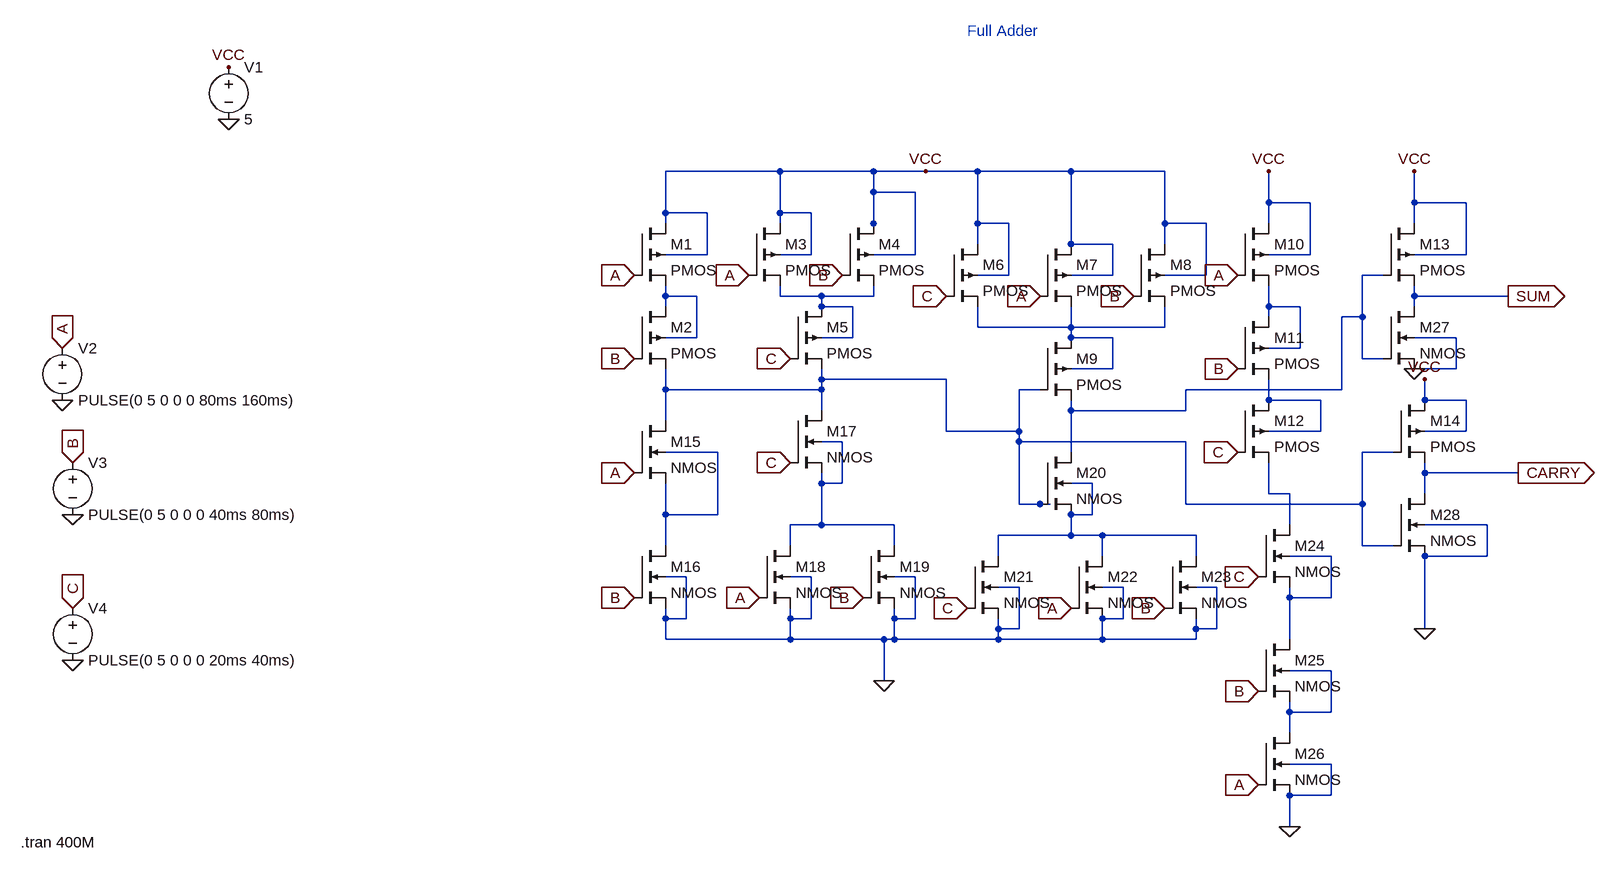
[diagram p0: schematic full adder.asc]
full adder.asc, the LTspice schematic file:
Version 4
SHEET 1 1472 1016
WIRE 128 -32 -48 -32
WIRE 272 -32 128 -32
WIRE 352 -32 272 -32
WIRE 432 -32 352 -32
WIRE 576 -32 432 -32
WIRE 720 -32 576 -32
WIRE 272 0 272 -32
WIRE 336 0 272 0
WIRE 880 16 880 -32
WIRE 944 16 880 16
WIRE 1104 16 1104 -32
WIRE 1184 16 1104 16
WIRE -48 32 -48 -32
WIRE 16 32 -48 32
WIRE 128 32 128 -32
WIRE 176 32 128 32
WIRE -48 48 -48 32
WIRE 128 48 128 32
WIRE 272 48 272 0
WIRE 432 48 432 -32
WIRE 480 48 432 48
WIRE 720 48 720 -32
WIRE 784 48 720 48
WIRE 880 48 880 16
WIRE 1104 48 1104 16
WIRE 272 64 272 48
WIRE 432 80 432 48
WIRE 576 80 576 -32
WIRE 640 80 576 80
WIRE 720 80 720 48
WIRE 16 96 16 32
WIRE 16 96 -48 96
WIRE 176 96 176 32
WIRE 176 96 128 96
WIRE 336 96 336 0
WIRE 336 96 272 96
WIRE 944 96 944 16
WIRE 944 96 880 96
WIRE 1184 96 1184 16
WIRE 1184 96 1104 96
WIRE 480 128 480 48
WIRE 480 128 432 128
WIRE 640 128 640 80
WIRE 640 128 576 128
WIRE 784 128 784 48
WIRE 784 128 720 128
WIRE 1056 128 1024 128
WIRE -48 160 -48 144
WIRE 0 160 -48 160
WIRE 128 160 128 144
WIRE 192 160 128 160
WIRE 272 160 272 144
WIRE 272 160 192 160
WIRE 1104 160 1104 144
WIRE 1248 160 1104 160
WIRE -48 176 -48 160
WIRE 192 176 192 160
WIRE 240 176 192 176
WIRE 880 176 880 144
WIRE 928 176 880 176
WIRE 1104 176 1104 160
WIRE 880 192 880 176
WIRE 1024 192 1024 128
WIRE 1024 192 992 192
WIRE 432 208 432 176
WIRE 576 208 576 176
WIRE 576 208 432 208
WIRE 720 208 720 176
WIRE 720 208 576 208
WIRE 0 224 0 160
WIRE 0 224 -48 224
WIRE 240 224 240 176
WIRE 240 224 192 224
WIRE 576 224 576 208
WIRE 640 224 576 224
WIRE 1168 224 1104 224
WIRE 928 240 928 176
WIRE 928 240 880 240
WIRE 1024 256 1024 192
WIRE 1056 256 1024 256
WIRE 640 272 640 224
WIRE 640 272 576 272
WIRE 1168 272 1168 224
WIRE 1168 272 1104 272
WIRE 192 288 192 272
WIRE 384 288 192 288
WIRE -48 304 -48 272
WIRE 192 304 192 288
WIRE 192 304 -48 304
WIRE 528 304 496 304
WIRE 992 304 992 192
WIRE 992 304 752 304
WIRE 880 320 880 288
WIRE 960 320 880 320
WIRE 1120 320 1120 288
WIRE 1184 320 1120 320
WIRE 192 336 192 304
WIRE 576 336 576 320
WIRE 752 336 752 304
WIRE 752 336 576 336
WIRE -48 352 -48 304
WIRE 384 368 384 288
WIRE 496 368 496 304
WIRE 496 368 384 368
WIRE 960 368 960 320
WIRE 960 368 880 368
WIRE 1184 368 1184 320
WIRE 1184 368 1120 368
WIRE 224 384 192 384
WIRE 496 384 496 368
WIRE 752 384 496 384
WIRE 32 400 -48 400
WIRE 576 400 576 336
WIRE 1072 400 1024 400
WIRE 1120 432 1120 416
WIRE 1264 432 1120 432
WIRE 192 448 192 432
WIRE 224 448 224 384
WIRE 224 448 192 448
WIRE 608 448 576 448
WIRE 880 464 880 416
WIRE 912 464 880 464
WIRE 1120 464 1120 432
WIRE 496 480 496 384
WIRE 528 480 496 480
WIRE 544 480 528 480
WIRE 752 480 752 384
WIRE 1024 480 1024 400
WIRE 1024 480 752 480
WIRE -48 496 -48 448
WIRE 32 496 32 400
WIRE 32 496 -48 496
WIRE 608 496 608 448
WIRE 608 496 576 496
WIRE 192 512 192 448
WIRE 192 512 144 512
WIRE 304 512 192 512
WIRE 912 512 912 464
WIRE 1216 512 1120 512
WIRE 576 528 576 496
WIRE 576 528 464 528
WIRE 624 528 576 528
WIRE 768 528 624 528
WIRE -48 544 -48 496
WIRE 144 544 144 512
WIRE 304 544 304 512
WIRE 1024 544 1024 480
WIRE 1072 544 1024 544
WIRE 464 560 464 528
WIRE 624 560 624 528
WIRE 768 560 768 528
WIRE 976 560 912 560
WIRE 1216 560 1216 512
WIRE 1216 560 1120 560
WIRE -16 592 -48 592
WIRE 176 592 144 592
WIRE 336 592 304 592
WIRE 496 608 464 608
WIRE 656 608 624 608
WIRE 800 608 768 608
WIRE 912 624 912 608
WIRE 976 624 976 560
WIRE 976 624 912 624
WIRE -48 656 -48 640
WIRE -16 656 -16 592
WIRE -16 656 -48 656
WIRE 144 656 144 640
WIRE 176 656 176 592
WIRE 176 656 144 656
WIRE 304 656 304 640
WIRE 336 656 336 592
WIRE 336 656 304 656
WIRE 656 656 656 608
WIRE 656 656 624 656
WIRE 464 672 464 656
WIRE 496 672 496 608
WIRE 496 672 464 672
WIRE 768 672 768 656
WIRE 800 672 800 608
WIRE 800 672 768 672
WIRE 1120 672 1120 560
WIRE -48 688 -48 656
WIRE 144 688 144 656
WIRE 144 688 -48 688
WIRE 288 688 144 688
WIRE 304 688 304 656
WIRE 304 688 288 688
WIRE 464 688 464 672
WIRE 464 688 304 688
WIRE 624 688 624 656
WIRE 624 688 464 688
WIRE 768 688 768 672
WIRE 768 688 624 688
WIRE 912 688 912 624
WIRE 976 736 912 736
WIRE 288 752 288 688
WIRE 912 800 912 784
WIRE 976 800 976 736
WIRE 976 800 912 800
WIRE 912 832 912 800
WIRE 976 880 912 880
WIRE 976 928 976 880
WIRE 976 928 912 928
WIRE 912 976 912 928
FLAG -96 128 A
IOPIN -96 128 In
FLAG -96 432 A
IOPIN -96 432 In
FLAG 80 128 A
IOPIN 80 128 In
FLAG 96 624 A
IOPIN 96 624 In
FLAG 528 160 A
IOPIN 528 160 In
FLAG 576 640 A
IOPIN 576 640 In
FLAG 864 912 A
IOPIN 864 912 In
FLAG 832 128 A
IOPIN 832 128 In
FLAG -96 256 B
IOPIN -96 256 In
FLAG -96 624 B
IOPIN -96 624 In
FLAG 224 128 B
IOPIN 224 128 In
FLAG 256 624 B
IOPIN 256 624 In
FLAG 672 160 B
IOPIN 672 160 In
FLAG 720 640 B
IOPIN 720 640 In
FLAG 864 768 B
IOPIN 864 768 In
FLAG 832 272 B
IOPIN 832 272 In
FLAG 144 256 C
IOPIN 144 256 In
FLAG 144 416 C
IOPIN 144 416 In
FLAG 416 640 C
IOPIN 416 640 In
FLAG 384 160 C
IOPIN 384 160 In
FLAG 832 400 C
IOPIN 832 400 In
FLAG 864 592 C
IOPIN 864 592 In
FLAG 288 752 0
FLAG 912 976 0
FLAG 1120 672 0
FLAG 1248 160 SUM
IOPIN 1248 160 Out
FLAG 1264 432 CARRY
IOPIN 1264 432 Out
FLAG 1104 -32 VCC
FLAG 880 -32 VCC
FLAG 1120 288 VCC
FLAG 352 -32 VCC
FLAG -720 -112 0
FLAG -976 320 0
FLAG -960 496 0
FLAG -960 720 0
FLAG -976 240 A
IOPIN -976 240 In
FLAG -960 416 B
IOPIN -960 416 In
FLAG -960 640 C
IOPIN -960 640 In
FLAG -720 -192 VCC
FLAG 1104 272 0
SYMBOL pmos4 -96 48 R0
SYMATTR InstName M1
SYMATTR Value2 l=90nm w=180nm
SYMBOL pmos4 -96 176 R0
SYMATTR InstName M2
SYMATTR Value2 l=90nm w=180nm
SYMBOL pmos4 80 48 R0
SYMATTR InstName M3
SYMATTR Value2 l=90nm w=180nm
SYMBOL pmos4 224 48 R0
SYMATTR InstName M4
SYMATTR Value2 l=90nm w=180nm
SYMBOL pmos4 144 176 R0
SYMATTR InstName M5
SYMATTR Value2 l=90nm w=180nm
SYMBOL pmos4 384 80 R0
SYMATTR InstName M6
SYMATTR Value2 l=90nm w=180nm
SYMBOL pmos4 528 80 R0
SYMATTR InstName M7
SYMATTR Value2 l=90nm w=180nm
SYMBOL pmos4 672 80 R0
SYMATTR InstName M8
SYMATTR Value2 l=90nm w=180nm
SYMBOL pmos4 528 224 R0
SYMATTR InstName M9
SYMATTR Value2 l=90nm w=180nm
SYMBOL pmos4 832 48 R0
SYMATTR InstName M10
SYMATTR Value2 l=90nm w=180nm
SYMBOL pmos4 832 192 R0
SYMATTR InstName M11
SYMATTR Value2 l=90nm w=180nm
SYMBOL pmos4 832 320 R0
SYMATTR InstName M12
SYMATTR Value2 l=90nm w=180nm
SYMBOL pmos4 1056 48 R0
SYMATTR InstName M13
SYMATTR Value2 l=90nm w=180nm
SYMBOL pmos4 1072 320 R0
SYMATTR InstName M14
SYMATTR Value2 l=90nm w=180nm
SYMBOL nmos4 -96 352 R0
SYMATTR InstName M15
SYMATTR Value2 l=90nm w=90nm
SYMBOL nmos4 -96 544 R0
SYMATTR InstName M16
SYMATTR Value2 l=90nm w=90nm
SYMBOL nmos4 144 336 R0
SYMATTR InstName M17
SYMATTR Value2 l=90nm w=90nm
SYMBOL nmos4 96 544 R0
SYMATTR InstName M18
SYMATTR Value2 l=90nm w=90nm
SYMBOL nmos4 256 544 R0
SYMATTR InstName M19
SYMATTR Value2 l=90nm w=90nm
SYMBOL nmos4 528 400 R0
SYMATTR InstName M20
SYMATTR Value2 l=90nm w=90nm
SYMBOL nmos4 416 560 R0
SYMATTR InstName M21
SYMATTR Value2 l=90nm w=90nm
SYMBOL nmos4 576 560 R0
SYMATTR InstName M22
SYMATTR Value2 l=90nm w=90nm
SYMBOL nmos4 720 560 R0
SYMATTR InstName M23
SYMATTR Value2 l=90nm w=90nm
SYMBOL nmos4 864 512 R0
SYMATTR InstName M24
SYMATTR Value2 l=90nm w=90nm
SYMBOL nmos4 864 688 R0
SYMATTR InstName M25
SYMATTR Value2 l=90nm w=90nm
SYMBOL nmos4 864 832 R0
SYMATTR InstName M26
SYMATTR Value2 l=90nm w=90nm
SYMBOL nmos4 1056 176 R0
SYMATTR InstName M27
SYMATTR Value2 l=90nm w=90nm
SYMBOL nmos4 1072 464 R0
SYMATTR InstName M28
SYMATTR Value2 l=90nm w=90nm
SYMBOL voltage -720 -208 R0
WINDOW 123 0 0 Left 0
WINDOW 39 0 0 Left 0
SYMATTR InstName V1
SYMATTR Value 5
SYMBOL voltage -976 224 R0
WINDOW 123 0 0 Left 0
WINDOW 39 0 0 Left 0
SYMATTR InstName V2
SYMATTR Value PULSE(0 5 0 0 0 80ms 160ms)
SYMBOL voltage -960 400 R0
WINDOW 123 0 0 Left 0
WINDOW 39 0 0 Left 0
SYMATTR InstName V3
SYMATTR Value PULSE(0 5 0 0 0 40ms 80ms)
SYMBOL voltage -960 624 R0
WINDOW 123 0 0 Left 0
WINDOW 39 0 0 Left 0
SYMATTR InstName V4
SYMATTR Value PULSE(0 5 0 0 0 20ms 40ms)
TEXT -1040 1000 Left 2 !.tran 400M
TEXT 416 -248 Left 2 ;Full Adder

The netlist it stands for:
* full adder.asc
M1 VCC A N002 VCC PMOS l=90nm w=180nm
M2 N002 B N006 N002 PMOS l=90nm w=180nm
M3 VCC A N003 VCC PMOS l=90nm w=180nm
M4 VCC B N003 VCC PMOS l=90nm w=180nm
M5 N003 C N006 N003 PMOS l=90nm w=180nm
M6 VCC C N005 VCC PMOS l=90nm w=180nm
M7 VCC A N005 VCC PMOS l=90nm w=180nm
M8 VCC B N005 VCC PMOS l=90nm w=180nm
M9 N005 N006 N001 N005 PMOS l=90nm w=180nm
M10 VCC A N004 VCC PMOS l=90nm w=180nm
M11 N004 B N007 N004 PMOS l=90nm w=180nm
M12 N007 C N011 N007 PMOS l=90nm w=180nm
M13 VCC N001 SUM VCC PMOS l=90nm w=180nm
M14 VCC N006 CARRY VCC PMOS l=90nm w=180nm
M15 N006 A N009 N009 NMOS l=90nm w=90nm
M16 N009 B 0 0 NMOS l=90nm w=90nm
M17 N006 C N008 N008 NMOS l=90nm w=90nm
M18 N008 A 0 0 NMOS l=90nm w=90nm
M19 N008 B 0 0 NMOS l=90nm w=90nm
M20 N001 N006 N010 N010 NMOS l=90nm w=90nm
M21 N010 C 0 0 NMOS l=90nm w=90nm
M22 N010 A 0 0 NMOS l=90nm w=90nm
M23 N010 B 0 0 NMOS l=90nm w=90nm
M24 N011 C N012 N012 NMOS l=90nm w=90nm
M25 N012 B N013 N013 NMOS l=90nm w=90nm
M26 N013 A 0 0 NMOS l=90nm w=90nm
M27 SUM N001 0 0 NMOS l=90nm w=90nm
M28 CARRY N006 0 0 NMOS l=90nm w=90nm
V1 VCC 0 5
V2 A 0 PULSE(0 5 0 0 0 80ms 160ms)
V3 B 0 PULSE(0 5 0 0 0 40ms 80ms)
V4 C 0 PULSE(0 5 0 0 0 20ms 40ms)
.model NMOS NMOS
.model PMOS PMOS
.lib standard.mos
.tran 400M
* Full Adder
.backanno
.end